# Altium schematic sheet LED_indicators.SchDoc: HV_Module
size 420 x 297 mm; EDA_Number: ARTIQ; Projet: HV_Module; Author: G.Kasprowicz; CompanyName: WUT ISE; DrawnBy: G.Kasprowicz; Organization: WUT ISE; Address1: PW ISE; Address2: Nowowiejska 15/19 00-665 Warsaw; Address3: gkasprow@gmail.com; DocumentNumber: 6; Revision: 1.0; SheetNumber: 6; SheetTotal: 6; ModifiedBy: -; CheckedDate: -; Title2: LED_Indicators; DivGrp: WUT ISE; Designer: G.Kasprowicz; ModifiedDate: -; ProjectName: Sensor Box
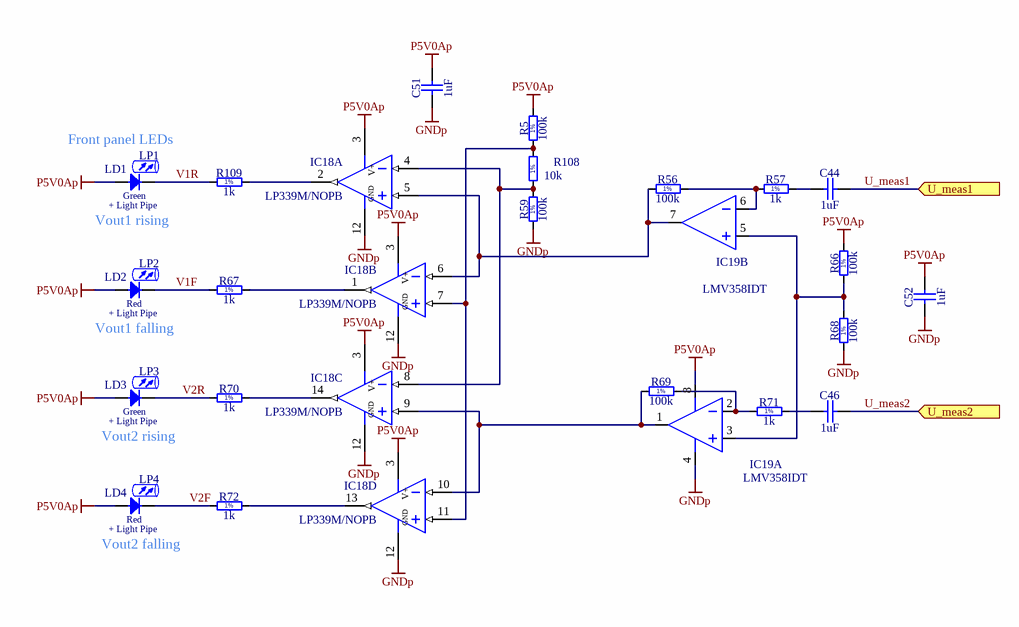
[diagram p0: LED_indicators.SchDoc]

## Parts
C44  1uF  [CAPC1005X55N]
C46  1uF  [CAPC1005X55N]
C51  1uF  [CAPC1005X55N]
C52  1uF  [CAPC1005X55N]
IC18  LP339M/NOPB  [SOIC127P600X175-14N]  (parts A,B,C,D of 4)
IC19  LMV358IDT  [SO-8]  (parts A,B of 2)
LD1  Green  [LED_DIALIGHT_555-230]
LD2  Red  [LED_DIALIGHT_555-200]
LD3  Green  [LED_DIALIGHT_555-230]
LD4  Red  [LED_DIALIGHT_555-200]
LP1  (no value)  [LEDLP_BIVAR_PLP2-1200]
LP2  (no value)  [LEDLP_BIVAR_PLP2-1200]
LP3  (no value)  [LEDLP_BIVAR_PLP2-1200]
LP4  (no value)  [LEDLP_BIVAR_PLP2-1200]
R5  100k  [RESC1608X55N]
R56  100k  [RESC1608X55N]
R57  1k  [RESC1005X40N]
R59  100k  [RESC1608X55N]
R66  100k  [RESC1608X55N]
R67  1k  [RESC1005X40N]
R68  100k  [RESC1608X55N]
R69  100k  [RESC1608X55N]
R70  1k  [RESC1005X40N]
R71  1k  [RESC1005X40N]
R72  1k  [RESC1005X40N]
R108  10k  [RESC1005X40N]
R109  1k  [RESC1005X40N]

## Ports
U_meas1 (in), U_meas2 (in)

## Nets
GNDp: C51.1 C52.1 IC18.12(GND) IC19.4(V-) R59.1 R68.1
P5V0Ap: C51.2 C52.2 IC18.3(V+) IC19.8(V+) LD1.2(A) LD2.2(A) LD3.2(A) LD4.2(A) R5.2 R66.2
U_meas1: C44.2 ; port U_meas1
U_meas2: C46.2 ; port U_meas2
V1F: LD2.1(C) R67.1
V1R: LD1.1(C) R109.1
V2F: LD4.1(C) R72.1
V2R: LD3.1(C) R70.1
NetC44_1: C44.1 R57.2
NetC46_1: C46.1 R71.2
NetIC18_1: IC18.1(OUT) R67.2
NetIC18_2: IC18.2(OUT) R109.2
NetIC18_4: IC18.4(IN-) IC18.8(IN-) R59.2 R108.1
NetIC18_5: IC18.5(IN+) IC18.6(IN-) IC19.7(OUT) R56.1
NetIC18_7: IC18.7(IN+) IC18.11(IN+) R5.1 R108.2
NetIC18_9: IC18.9(IN+) IC18.10(IN-) IC19.1(OUT) R69.1
NetIC18_13: IC18.13(OUT) R72.2
NetIC18_14: IC18.14(OUT) R70.2
NetIC19_2: IC19.2(IN-) R69.2 R71.1
NetIC19_3: IC19.3(IN+) IC19.5(IN+) R66.1 R68.2
NetIC19_6: IC19.6(IN-) R56.2 R57.1

## Notes on the sheet
- Front panel LEDs
- Vout1 rising
- Vout1 falling
- Vout2 rising
- Vout2 falling
- Project/Equipment
- Document
- Designer
- Drawn by
- Check.by
- Copyright WUT ISE 2020.
  This documentation describes Open Hardware and is licensed under the CERN OHL v.1.2. You may redistribute and modify this documentation under the terms of the CERN OHL v.1.2. (http://ohwr.org/CERNOHL). This documentation is distributed WITHOUT ANY EXPRESS OR IMPLIED WARRANTY, INCLUDING OF MERCHANTABILITY, SATISFACTORY QUALITY AND FITNESS FOR A PARTICULAR PURPOSE. Please see the CERN OHL v.1.2 for applicable conditions.
- Contact
- File
- Last Mod.
- Print Date
- Sheet
- Size
- A3
- of
- Rev
- (in symbol LEDLP_BIVAR_PLP2-1200) + Light Pipe
- (in symbol R0402_1K_1%_0.0625W_100PPM) 1%
- (in symbol R0402_10K_1%_0.0625W_100PPM) 1%
- (in symbol R0603_100K_1%_0.1W_100PPM) 1%

## Library data of the parts
C44 C46 C51 C52 = CC0402_1UF_16V_10%_X5R: Non-polarised capacitor; Part Description: SMD Multilayer Chip Ceramic Capacitor; Manufacturer: GENERIC; Manufacturer1 Part Number: C1005X5R1C105KT; Voltage: 16V; TC: X5R; Tolerance: ±10%; Part Number: CC0402_1UF_16V_10%_X5R; Component Kind: Standard; Component Type: Standard; Pin Count: 2; Value: 1uF; Status: Preferred; Manufacturer Part Number: CC0402_1UF_16V_10%_X5R; Case: 0402; Mounted: Yes; Socket: No; SMD: Yes; Sense: No; Manufacturer1 Example: TDK; Manufacturer1 ComponentHeight: 0.55mm; HelpURL: \\cern.ch\dfs\Applications\Altium\Datasheets\CC0402_X5R_TDK_C.pdf; Author: CERN DEM JLC; CreateDate: 2012-10-25; LatestRevisionDate: 2012-10-25
IC18 = LP339M/NOPB: Quad Operational Amplifier; Part Description: Ultra-Low Power Quad Comparator; Manufacturer: TEXAS INSTRUMENTS; PressFit: No; Bonding: No; Part Number: LP339M/NOPB; Component Kind: Standard; Component Type: Standard; Device: LP339M/NOPB; PackageDescription: SOIC 14, Pitch 1.27mm - Body 4x8.75mm, IPC Medium Density; Manufacturer Part Number: LP339M/NOPB; Pin Count: 14; Case: SOIC14; Mounted: Yes; Socket: No; SMD: Yes; Sense: No; ComponentHeight: 1.75mm; Author: CERN DEM MR; HelpURL: \\cern.ch\dfs\Applications\Altium\Datasheets\LP339M-NOPB.pdf; CreateDate: 23.03.2016; LatestRevisionDate: 23.03.2016
IC19 = OA_LMV358: Low voltage, Rail-to_Rail output Operational Amplifier
LD1 LD3 = LED_DIALIGHT_555-2301F: LED Green 1C 2A; Part Description: Single 2mm Green LED CBI® Circuit Board Indicator; PressFit: No; Bonding: No; Part Number: LED_DIALIGHT_555-2301F; Component Kind: Standard; Component Type: Standard; Color: Green; PackageDescription: Single 2mm Green LED, Body 5.08x2.54mm, Pin spacing 2.54mm; Manufacturer: DIALIGHT; Manufacturer Part Number: 555-2301F; Pin Count: 2; Mounted: Yes; Socket: No; SMD: No; Sense: No; ComponentHeight: 6.35mm; HelpURL: \\cern.ch\dfs\Applications\Altium\Datasheets\LED_DIALIGHT_555-2301F.pdf; Author: CERN DEM JMW; CreateDate: 22.09.2008; LatestRevisionDate: 17.03.2010
LD2 LD4 = LED_DIALIGHT_555-2001F: LED Red 1C 2A; Part Description: Single 2mm Red LED CBI® Circuit Board Indicator; PressFit: No; Bonding: No; Part Number: LED_DIALIGHT_555-2001F; Component Kind: Standard; Component Type: Standard; Color: Red; PackageDescription: Single 2mm Red LED, Body 5.08x2.54mm, Pin spacing 2.54mm; Manufacturer: DIALIGHT; Manufacturer Part Number: 555-2001F; Pin Count: 2; Mounted: Yes; Socket: No; SMD: No; Sense: No; ComponentHeight: 6.35mm; HelpURL: \\cern.ch\dfs\Applications\Altium\Datasheets\LED_DIALIGHT_555-2001F.pdf; Author: CERN DEM JMW; CreateDate: 22.09.2008; LatestRevisionDate: 17.03.2010
LP1-LP4 = LEDLP_BIVAR_PLP2-1200: LED Light Pipe x1 Type1; Part Description: 3mm Dome Leens, Single Station Vertivcal Round Lightpipe Height 1.2 in. (30.5mm); Manufacturer: BIVAR; PressFit: No; Bonding: No; Part Number: LEDLP_BIVAR_PLP2-1200; Component Kind: Accessories; Component Type: Standard; PackageDescription: 3mm Dome Leens, Single Station Vertivcal Round Lightpipe Height 1.2 in. (30.5mm); Manufacturer Part Number: PLP2-1200; Pin Count: 0; Mounted: Yes; Socket: No; SMD: No; Sense: No; ComponentHeight: 31.3mm; HelpURL: \\cern.ch\dfs\Applications\Altium\Datasheets\LEDLP_BIVAR_PLP2-1200.pdf; Author: CERN DEM HF; CreateDate: 09.02.2022; LatestRevisionDate: 09.02.2022
R5 R56 R59 R66 R68 R69 = R0603_100K_1%_0.1W_100PPM: Resistor - 1%; Part Description: General Purpose Thick Film Chip Resistor; Manufacturer: GENERIC; Manufacturer1 Part Number: NRC06F1003TRF; Power: 0.1W; TC: ±100ppm/°C; Part Number: R0603_100K_1%_0.1W_100PPM; Component Kind: Standard; Component Type: Standard; Pin Count: 2; Value: 100k; Status: Preferred; Tolerance: ±1%; Manufacturer Part Number: R0603_100K_1%_0.1W_100PPM; Case: 0603; Mounted: Yes; Sense: No; Socket: No; SMD: Yes; Manufacturer1 Example: NIC COMPONENT; Manufacturer1 ComponentHeight: 0.55mm; HelpURL: \\cern.ch\dfs\Applications\Altium\Datasheets\R0603_NIC_NRC.pdf; Author: CERN DEM JLC; CreateDate: 2007-12-03; LatestRevisionDate: 2008-03-13
R57 R67 R70-R72 R109 = R0402_1K_1%_0.0625W_100PPM: Resistor - 1%; Part Description: General Purpose Thick Film Chip Resistor; Manufacturer: GENERIC; Manufacturer1 Part Number: 232270671002L; TC: ±100ppm/°C; Part Number: R0402_1K_1%_0.0625W_100PPM; Component Kind: Standard; Component Type: Standard; Pin Count: 2; Value: 1k; Status: Not recommended; Power: 0.0625W; Tolerance: ±1%; Manufacturer Part Number: R0402_1K_1%_0.0625W_100PPM; Case: 0402; Mounted: Yes; Sense: No; Socket: No; SMD: Yes; Manufacturer1 Example: YAGEO PHYCOMP; Manufacturer1 ComponentHeight: 0.4mm; HelpURL: \\cern.ch\dfs\Applications\Altium\Datasheets\R0402_Phycomp_RC0402.pdf; Author: CERN DEM JLC; CreateDate: 2007-12-03; LatestRevisionDate: 2012-10-17
R108 = R0402_10K_1%_0.0625W_100PPM: Resistor - 1%; Part Description: General Purpose Thick Film Chip Resistor; Manufacturer: GENERIC; Manufacturer1 Part Number: 232270671003L; TC: ±100ppm/°C; Part Number: R0402_10K_1%_0.0625W_100PPM; Component Kind: Standard; Component Type: Standard; Pin Count: 2; Value: 10k; Status: Not recommended; Power: 0.0625W; Tolerance: ±1%; Manufacturer Part Number: R0402_10K_1%_0.0625W_100PPM; Case: 0402; Mounted: Yes; Sense: No; Socket: No; SMD: Yes; Manufacturer1 Example: YAGEO PHYCOMP; Manufacturer1 ComponentHeight: 0.4mm; HelpURL: \\cern.ch\dfs\Applications\Altium\Datasheets\R0402_Phycomp_RC0402.pdf; Author: CERN DEM JLC; CreateDate: 2007-12-03; LatestRevisionDate: 2012-10-17